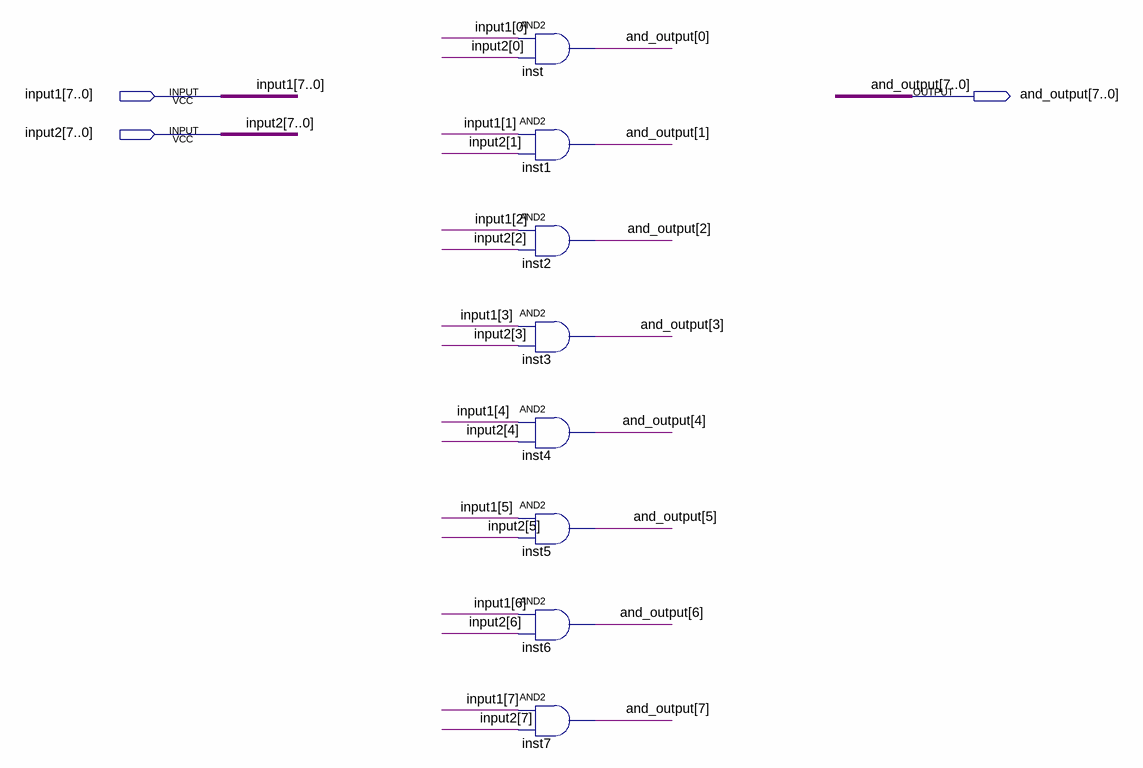
[diagram p0: schematic sheet]
// Quartus schematic AND_8bit.bdf as structural Verilog: 8 symbols, 3 pins
module AND_8bit (
  input  [7:0] input1,
  input  [7:0] input2,
  output [7:0] and_output
);

  and inst (and_output[0], input1[0], input2[0]);
  and inst1 (and_output[1], input1[1], input2[1]);
  and inst2 (and_output[2], input1[2], input2[2]);
  and inst3 (and_output[3], input1[3], input2[3]);
  and inst4 (and_output[4], input1[4], input2[4]);
  and inst5 (and_output[5], input1[5], input2[5]);
  and inst6 (and_output[6], input1[6], input2[6]);
  and inst7 (and_output[7], input1[7], input2[7]);
endmodule
